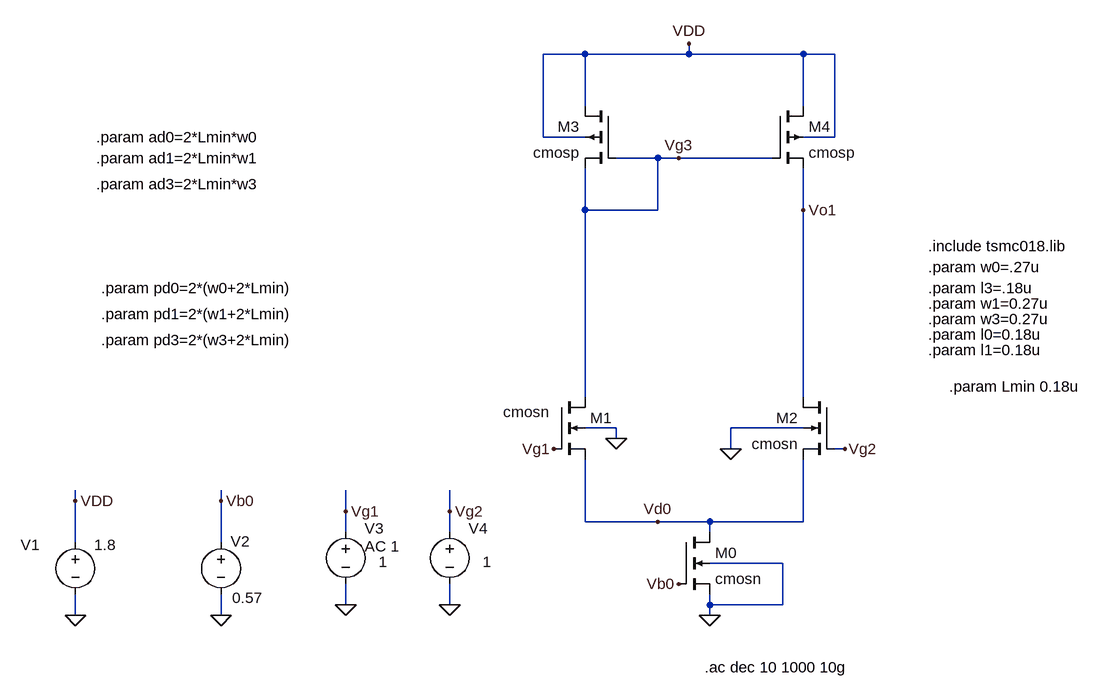
[diagram p0: schematic my opamp.asc]
my opamp.asc, the LTspice schematic file:
Version 4
SHEET 1 1132 1028
WIRE 352 32 288 32
WIRE 512 32 512 16
WIRE 512 32 352 32
WIRE 688 32 512 32
WIRE 736 32 688 32
WIRE 352 112 352 32
WIRE 688 112 688 32
WIRE 288 160 288 32
WIRE 352 160 288 160
WIRE 736 160 736 32
WIRE 736 160 688 160
WIRE 464 192 400 192
WIRE 496 192 464 192
WIRE 640 192 496 192
WIRE 352 272 352 208
WIRE 464 272 464 192
WIRE 464 272 352 272
WIRE 688 272 688 208
WIRE 352 560 352 272
WIRE 688 560 688 272
WIRE 400 608 352 608
WIRE 688 608 576 608
WIRE 400 624 400 608
WIRE 576 640 576 608
WIRE 752 640 736 640
WIRE -432 720 -432 704
WIRE -208 720 -208 704
WIRE -16 736 -16 704
WIRE 144 736 144 704
WIRE 352 752 352 656
WIRE 464 752 352 752
WIRE 544 752 464 752
WIRE 688 752 688 656
WIRE 688 752 544 752
WIRE -16 768 -16 736
WIRE 144 768 144 736
WIRE 544 768 544 752
WIRE -432 784 -432 720
WIRE -208 784 -208 720
WIRE 656 816 544 816
WIRE -16 880 -16 848
WIRE 144 880 144 848
WIRE 544 880 544 864
WIRE 656 880 656 816
WIRE 656 880 544 880
WIRE -432 896 -432 864
WIRE -208 896 -208 864
WIRE 544 896 544 880
FLAG -208 896 0
FLAG -432 896 0
FLAG 544 896 0
FLAG 688 272 Vo1
FLAG 400 624 0
FLAG 464 752 Vd0
FLAG 496 192 Vg3
FLAG 576 640 0
FLAG -16 880 0
FLAG -432 720 VDD
FLAG -208 720 Vb0
FLAG -16 736 Vg1
FLAG 304 640 Vg1
FLAG 752 640 Vg2
FLAG 496 848 Vb0
FLAG 512 16 VDD
FLAG 144 880 0
FLAG 144 736 Vg2
DATAFLAG 576 752 ""
DATAFLAG 688 464 ""
DATAFLAG 352 336 ""
SYMBOL voltage -432 768 R0
WINDOW 123 0 0 Left 0
WINDOW 39 0 0 Left 0
WINDOW 3 29 20 Left 2
WINDOW 0 -84 20 Left 2
SYMATTR Value 1.8
SYMATTR InstName V1
SYMBOL voltage -208 768 R0
WINDOW 123 0 0 Left 0
WINDOW 39 0 0 Left 0
WINDOW 3 17 101 Left 2
WINDOW 0 15 14 Left 2
SYMATTR Value 0.57
SYMATTR InstName V2
SYMBOL nmos4 304 560 R0
WINDOW 3 -78 23 Left 2
SYMATTR Value cmosn
SYMATTR InstName M1
SYMATTR Value2 l={l1} w={w1} ad={ad1} as={ad1} pd={pd1} ps={pd1}
SYMBOL nmos4 736 560 M0
SYMATTR InstName M2
SYMATTR Value cmosn
SYMATTR Value2 l={l1} w={w1} ad={ad1} as={ad1} pd={pd1} ps={pd1}
SYMBOL nmos4 496 768 R0
SYMATTR InstName M0
SYMATTR Value cmosn
SYMATTR Value2 l={l0} w={w0} ad={ad0} as={ad0} pd={pd0} ps={pd0}
SYMBOL pmos4 640 112 R0
SYMATTR InstName M4
SYMATTR Value cmosp
SYMATTR Value2 l={l3} w={w3} ad={ad3} as={ad3} pd={pd3} ps={pd3}
SYMBOL pmos4 400 112 M0
SYMATTR InstName M3
SYMATTR Value cmosp
SYMATTR Value2 l={l3} w={w3} ad={ad3} as={ad3} pd={pd3} ps={pd3}
SYMBOL voltage -16 752 R0
WINDOW 3 51 62 Left 2
WINDOW 123 29 38 Left 2
WINDOW 39 0 0 Left 0
WINDOW 0 29 10 Left 2
SYMATTR Value 1
SYMATTR Value2 AC 1
SYMATTR InstName V3
SYMBOL voltage 144 752 R0
WINDOW 3 51 62 Left 2
WINDOW 123 29 38 Left 2
WINDOW 39 0 0 Left 0
WINDOW 0 29 10 Left 2
SYMATTR Value 1
SYMATTR InstName V4
TEXT 880 328 Left 2 !.include tsmc018.lib
TEXT 880 392 Left 2 !.param l3=.18u
TEXT 880 360 Left 2 !.param w0=.27u
TEXT 536 976 Left 2 !.ac dec 10 1000 10g
TEXT 880 416 Left 2 !.param w1=0.27u
TEXT 880 440 Left 2 !.param w3=0.27u
TEXT 880 464 Left 2 !.param l0=0.18u
TEXT 880 488 Left 2 !.param l1=0.18u
TEXT -400 160 Left 2 !.param ad0=2*Lmin*w0
TEXT -400 192 Left 2 !.param ad1=2*Lmin*w1
TEXT -400 232 Left 2 !.param ad3=2*Lmin*w3
TEXT -392 392 Left 2 !.param pd0=2*(w0+2*Lmin)
TEXT -392 432 Left 2 !.param pd1=2*(w1+2*Lmin)
TEXT -392 472 Left 2 !.param pd3=2*(w3+2*Lmin)
TEXT 912 544 Left 2 !.param Lmin 0.18u

The netlist it stands for:
* my opamp.asc
V1 VDD 0 1.8
V2 Vb0 0 0.57
M1 Vg3 Vg1 Vd0 0 cmosn l={l1} w={w1} ad={ad1} as={ad1} pd={pd1} ps={pd1}
M2 Vo1 Vg2 Vd0 0 cmosn l={l1} w={w1} ad={ad1} as={ad1} pd={pd1} ps={pd1}
M0 Vd0 Vb0 0 0 cmosn l={l0} w={w0} ad={ad0} as={ad0} pd={pd0} ps={pd0}
M4 VDD Vg3 Vo1 VDD cmosp l={l3} w={w3} ad={ad3} as={ad3} pd={pd3} ps={pd3}
M3 VDD Vg3 Vg3 VDD cmosp l={l3} w={w3} ad={ad3} as={ad3} pd={pd3} ps={pd3}
V3 Vg1 0 1 AC 1
V4 Vg2 0 1
.model NMOS NMOS
.model PMOS PMOS
.lib standard.mos
.include tsmc018.lib
.param l3=.18u
.param w0=.27u
.ac dec 10 1000 10g
.param w1=0.27u
.param w3=0.27u
.param l0=0.18u
.param l1=0.18u
.param ad0=2*Lmin*w0
.param ad1=2*Lmin*w1
.param ad3=2*Lmin*w3
.param pd0=2*(w0+2*Lmin)
.param pd1=2*(w1+2*Lmin)
.param pd3=2*(w3+2*Lmin)
.param Lmin 0.18u
.backanno
.end